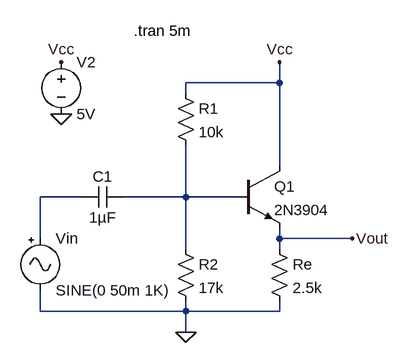
[diagram p0: schematic emitter-follower.asc]
emitter-follower.asc, the LTspice schematic file:
Version 4
SHEET 1 880 680
WIRE 240 -16 240 -48
WIRE 240 -16 96 -16
WIRE 96 0 96 -16
WIRE 240 112 240 -16
WIRE -64 160 -128 160
WIRE 96 160 96 80
WIRE 96 160 0 160
WIRE 176 160 96 160
WIRE -128 224 -128 160
WIRE 240 224 240 208
WIRE 352 224 240 224
WIRE 96 240 96 160
WIRE 240 240 240 224
WIRE -128 336 -128 304
WIRE 96 336 96 320
WIRE 96 336 -128 336
WIRE 240 336 240 320
WIRE 240 336 96 336
WIRE 96 368 96 336
FLAG 96 368 0
FLAG 240 -48 Vcc
FLAG -96 32 0
FLAG -96 -48 Vcc
FLAG 352 224 Vout
SYMBOL npn 176 112 R0
SYMATTR InstName Q1
SYMATTR Value 2N3904
SYMBOL res 80 -16 R0
SYMATTR InstName R1
SYMATTR Value 10k
SYMBOL res 80 224 R0
SYMATTR InstName R2
SYMATTR Value 17k
SYMBOL res 224 224 R0
SYMATTR InstName Re
SYMATTR Value 2.5k
SYMBOL cap 0 144 R90
WINDOW 0 0 32 VBottom 2
WINDOW 3 32 32 VTop 2
SYMATTR InstName C1
SYMATTR Value 1µF
SYMBOL Misc\\signal -128 208 R0
WINDOW 123 0 0 Left 0
WINDOW 39 0 0 Left 0
SYMATTR InstName Vin
SYMATTR Value SINE(0 50m 1K)
SYMBOL voltage -96 -64 R0
SYMATTR InstName V2
SYMATTR Value 5V
TEXT 16 -96 Left 2 !.tran 5m

The netlist it stands for:
* emitter-follower.asc
Q1 Vcc N002 Vout 0 2N3904
R1 Vcc N002 10k
R2 N002 0 17k
Re Vout 0 2.5k
C1 N002 N001 1µF
Vin N001 0 SINE(0 50m 1K)
V2 Vcc 0 5V
.model NPN NPN
.model PNP PNP
.lib standard.bjt
.tran 5m
.backanno
.end